# EAGLE design LB_BIT_i3_BUTTON-v02(rev1) (EAGLE 6.6.0)
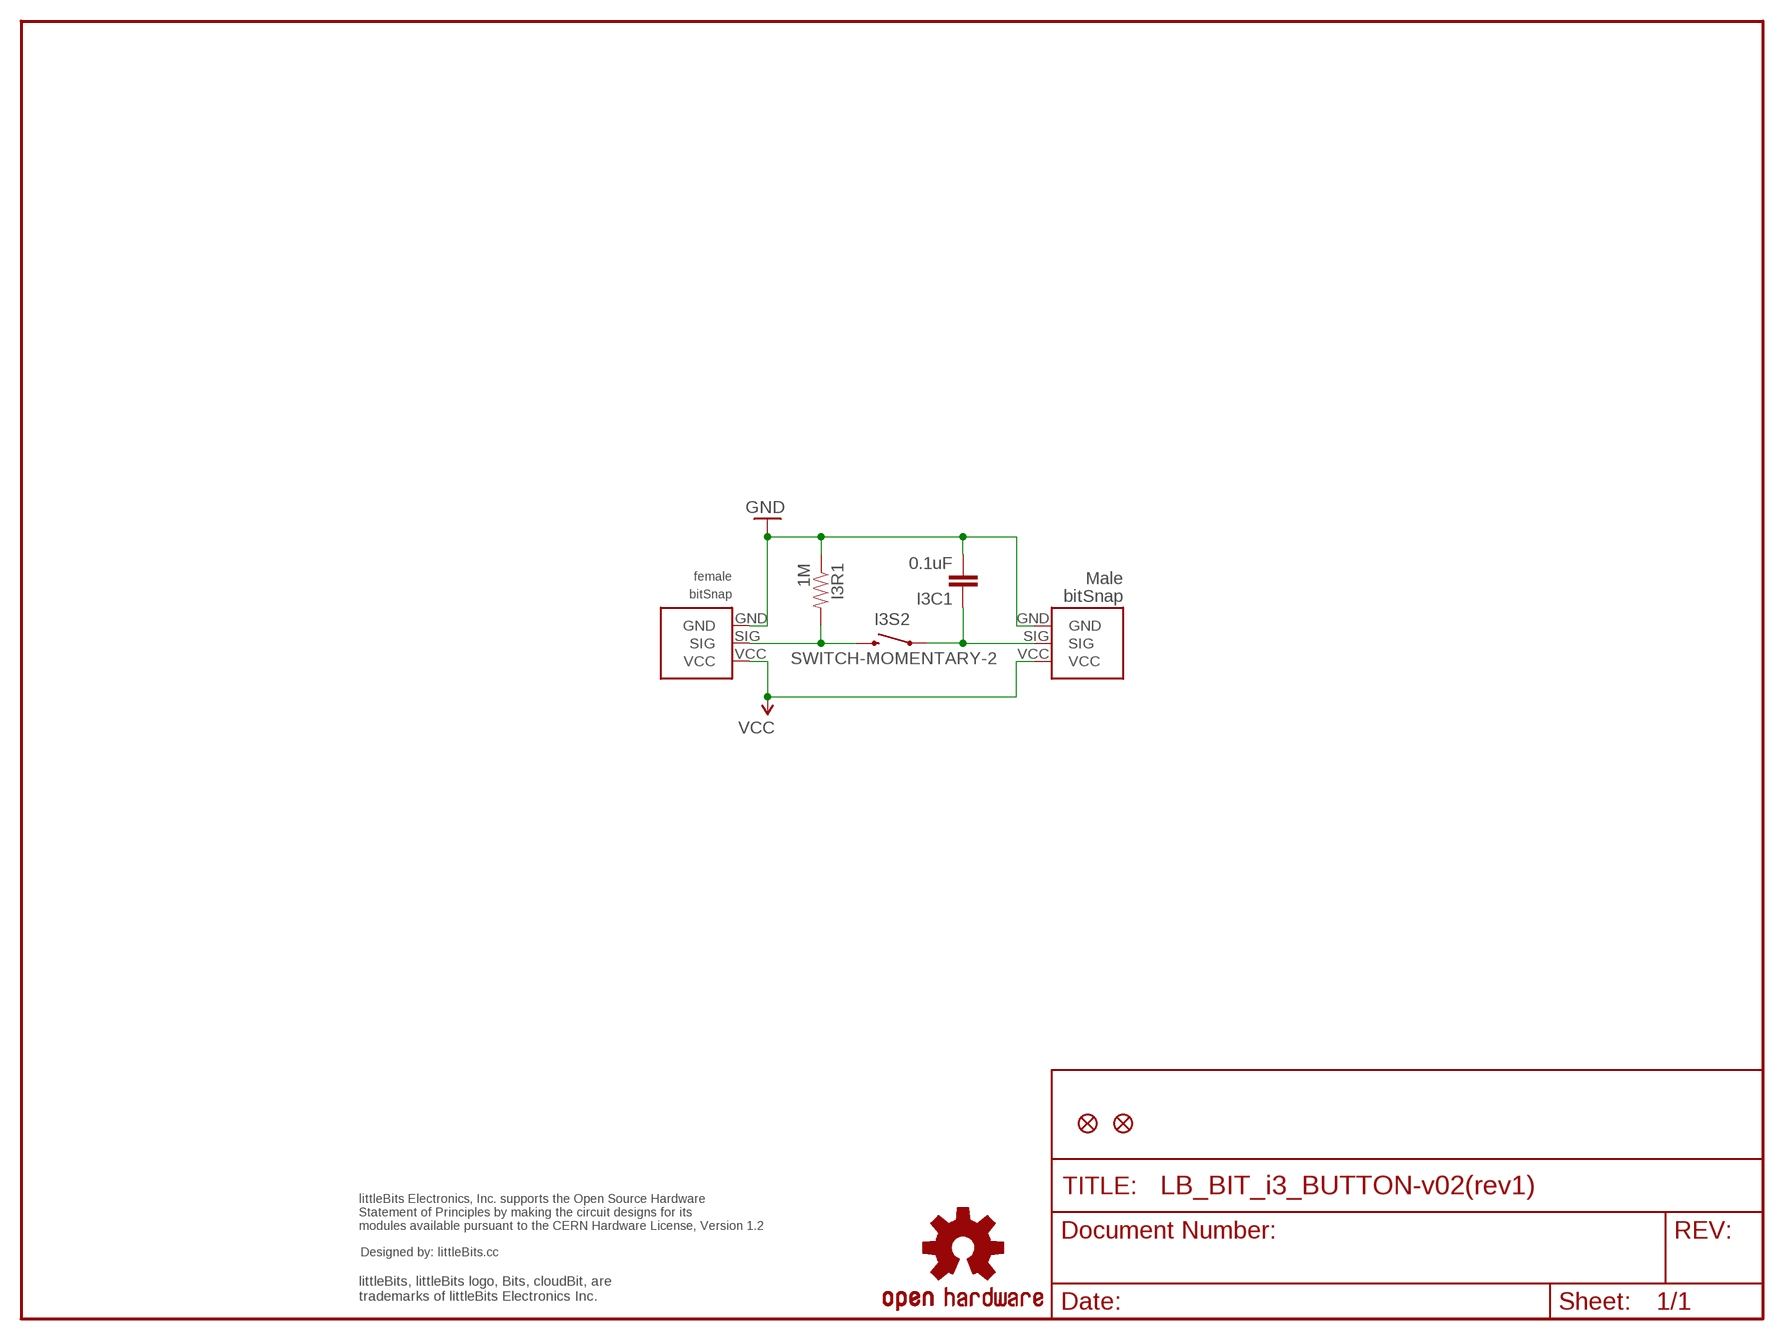
[diagram p0: schematic, sheet 1]

## Parts
I3BSF  BITSNAP_FEMALE  [BITSNAP_FEMALE]
I3BSM  BITSNAP_MALE  [BITSNAP_MALE]
I3C1  0.1uF  CAP0603-CAP  [0603-CAP]
I3R1  1M  RESISTOR0603-RES  [0603-RES]
I3S2  SWITCH-MOMENTARY-2  [TACTILE_SWITCH_TALL]
JP1  FIDUCIAL1X2.5  [FIDUCIAL-1X2.5]
JP2  FIDUCIAL1X2.5  [FIDUCIAL-1X2.5]
U$1  OSHW-LOGOL  [OSHW-LOGO-L]
U$2  OSHWCREDIT  [OSHWCREDIT]

## Nets
GND: I3BSF.GND I3BSM.GND I3C1.2 I3R1.1
SIG: I3BSF.SIG I3R1.2 I3S2.B2
SIG2: I3BSM.SIG I3C1.1 I3S2.A2
VCC: I3BSF.VCC I3BSM.VCC

## Library data of the parts
I3BSF = bitSnap:BITSNAP_FEMALE
I3BSM = bitSnap:BITSNAP_MALE
I3C1 = SparkFun:CAP: Capacitor Standard 0603 ceramic capacitor, and 0.1" leaded capacitor.
I3R1 = SparkFun:RESISTOR: Resistor Basic schematic elements and footprints for 0603, 1206, and PTH 1/10th watt (small) resistors.
I3S2 = SparkFun:SWITCH-MOMENTARY-2
JP1 JP2 = abes:FIDUCIAL: Fiducial Alignment Points Various fiducial points for machine vision alignment.
U$1 = SparkFun:OSHW-LOGO: Open Source Hardware Logo This logo indicates the piece of hardware it is found on incorporates a OSHW license and/or adheres to the definition of open source hardware found here: http://freedomdefined.org/OSHW
U$2 = LITTLEBITS:OSHWCREDIT

## Board
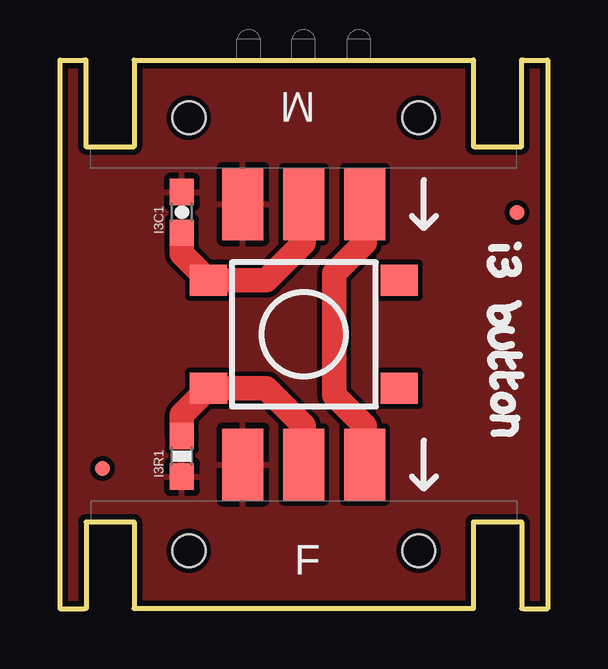
[diagram p1: board, top side]
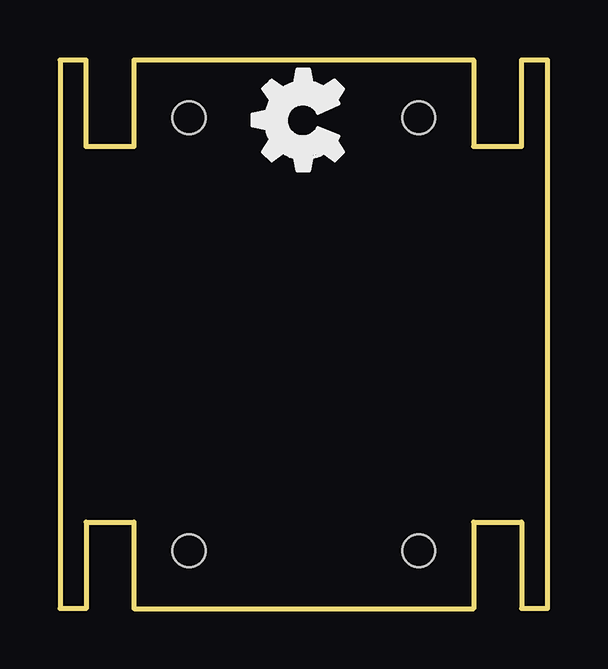
[diagram p2: board, bottom side, seen from below]

Size 20.32 x 22.86 mm. Coordinates in mm from the lower left corner, seen from the top.
Outline: 1.02,22.86 0,22.86 0,0 1.02,0
Outline: 19.3,22.86 20.32,22.86 20.32,0 19.3,0
Copper layers (1*16): Top 0.035mm / dielectric 1.5mm / Bottom 0.035mm
Design rules "default": minimum track width 8mil, minimum drill 20mil, track to track 8mil, track to pad 8mil, pad to pad 8mil, via to via 8mil, smd to smd 8mil, copper to edge 9mil, drill to drill 8mil, minimum pad ring 12mil, minimum via ring 10mil, stop-mask expansion 4mil, vias tented up to drill 20mil, thermal gap 10mil

### Footprints (pad centres in the part's own frame; a part is rotated, then mirrored left to right if it is on the bottom)
BITSNAP_FEMALE = smd 1.7 x 3: GND 6.35,6; SIG 8.89,6; VCC 11.43,6 | hole 1.37: 13.68,2.41; 4.1,2.41
BITSNAP_MALE = smd 1.7 x 3: GND 11.43,6; SIG 8.89,6; VCC 6.35,6 | hole 1.37: 13.68,2.41; 4.1,2.41
0603-CAP = smd 1.1 x 1: 1 -0.85,0; 2 0.85,0
0603-RES = smd 1.1 x 1: 1 -0.85,0; 2 0.85,0
TACTILE_SWITCH_TALL = smd 1.55 x 1.3: A1 -3.975,-2.25; A2 3.975,-2.25; B1 -3.975,2.25; B2 3.975,2.25
FIDUCIAL-1X2.5 = smd 0.635 x 0.635: 1 0,0

### Placement (x,y rotation side)
I3BSF  1.27,0 0 top
I3BSM  19.05,22.86 180 top
I3C1  5.08,16.51 90 top
I3R1  5.08,6.35 90 top
I3S2  10.16,11.43 180 top
JP1  19.05,16.51 0 top
JP2  1.78,5.84 0 top
U$1  -22.86,-15.24 0 top  (outside the outline)
U$2  -13.97,-17.78 0 top  (outside the outline)
U$3  [OSHW_FILLX150_NOTEXT]  8.51,17.4 0 top

### Tracks (layer width: path | path; a pad name or v marks a point on that pad's centre or on a via)
GND
  pour Top: 0,0 0,22.86 20.32,22.86 20.32,0
SIG
  Top 1.016: I3BSF.SIG 10.16,7.62 8.6,9.18 I3S2.B2 5.08,8.07 I3R1.2
SIG2
  Top 1.016: I3BSM.SIG 10.16,15.24 8.6,13.68 I3S2.A2 5.08,14.79 I3C1.1
VCC
  Top 1.016: I3BSM.VCC 12.7,15.24 11.43,13.97 11.43,8.89 12.7,7.62 I3BSF.VCC